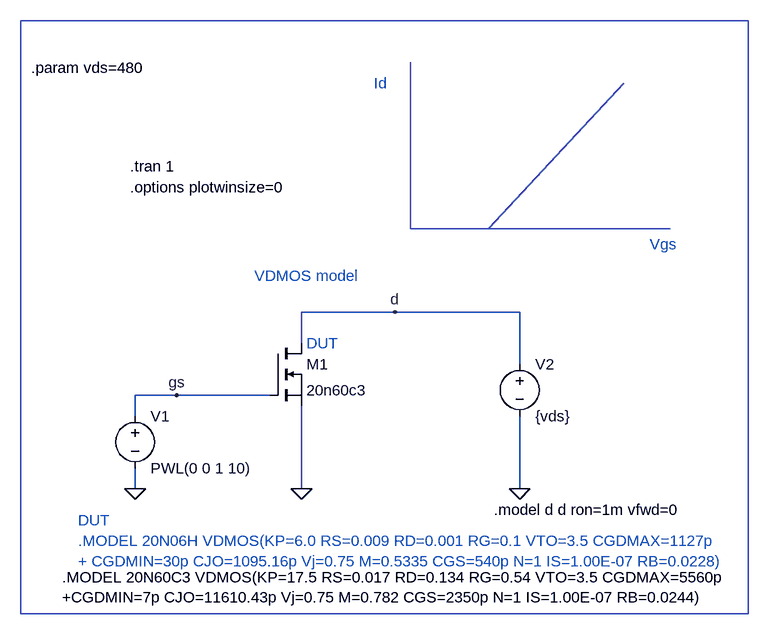
[diagram p0: schematic nmos_model_transfer.asc]
nmos_model_transfer.asc, the LTspice schematic file:
Version 4
SHEET 1 2828 1468
WIRE 416 416 272 416
WIRE 608 416 416 416
WIRE 272 464 272 416
WIRE 608 496 608 416
WIRE 80 544 16 544
WIRE 224 544 80 544
WIRE 16 576 16 544
WIRE 16 688 16 656
WIRE 272 688 272 560
WIRE 608 688 608 576
FLAG 16 688 0
FLAG 272 688 0
FLAG 80 544 gs
FLAG 416 416 d
FLAG 608 688 0
SYMBOL voltage 16 560 R0
WINDOW 123 0 0 Left 0
WINDOW 39 0 0 Left 0
SYMATTR InstName V1
SYMATTR Value PWL(0 0 1 10)
SYMBOL nmos 224 464 R0
SYMATTR InstName M1
SYMATTR Value 20n60c3
SYMBOL voltage 608 480 R0
WINDOW 123 0 0 Left 0
WINDOW 39 0 0 Left 0
SYMATTR InstName V2
SYMATTR Value {vds}
TEXT 8 192 Left 0 !.tran 1
TEXT 384 64 Left 0 ;Id
TEXT 808 312 Left 0 ;Vgs
TEXT 8 224 Left 0 !.options plotwinsize=0
TEXT 200 360 Left 0 ;VDMOS model
TEXT -72 768 Left 0 ;.MODEL 20N06H VDMOS(KP=6.0 RS=0.009 RD=0.001 RG=0.1 VTO=3.5 CGDMAX=1127p \n+ CGDMIN=30p CJO=1095.16p Vj=0.75 M=0.5335 CGS=540p N=1 IS=1.00E-07 RB=0.0228)
TEXT -144 40 Left 0 !.param vds=480
TEXT 568 720 Left 0 !.model d d ron=1m vfwd=0
TEXT 280 464 Left 0 ;DUT
TEXT -72 736 Left 0 ;DUT
TEXT -96 824 Left 0 !.MODEL 20N60C3 VDMOS(KP=17.5 RS=0.017 RD=0.134 RG=0.54 VTO=3.5 CGDMAX=5560p \n+CGDMIN=7p CJO=11610.43p Vj=0.75 M=0.782 CGS=2350p N=1 IS=1.00E-07 RB=0.0244)
LINE Normal 440 288 440 32
LINE Normal 840 288 440 288
LINE Normal 560 288 448 288
LINE Normal 768 64 560 288
RECTANGLE Normal 960 880 -160 -32

The netlist it stands for:
* nmos_model_transfer.asc
V1 gs 0 PWL(0 0 1 10)
M1 d gs 0 0 20n60c3
V2 d 0 {vds}
.model NMOS NMOS
.model PMOS PMOS
.lib standard.mos
.tran 1
* Id
* Vgs
.options plotwinsize=0
* VDMOS model
* .MODEL 20N06H VDMOS(KP=6.0 RS=0.009 RD=0.001 RG=0.1 VTO=3.5 CGDMAX=1127p
* + CGDMIN=30p CJO=1095.16p Vj=0.75 M=0.5335 CGS=540p N=1 IS=1.00E-07 RB=0.0228)
.param vds=480
.model d d ron=1m vfwd=0
* DUT
* DUT
.MODEL 20N60C3 VDMOS(KP=17.5 RS=0.017 RD=0.134 RG=0.54 VTO=3.5 CGDMAX=5560p
+CGDMIN=7p CJO=11610.43p Vj=0.75 M=0.782 CGS=2350p N=1 IS=1.00E-07 RB=0.0244)
.backanno
.end